# Altium schematic sheet Power_Supply.SchDoc
size A4; CompanyName: Technische Hochschule Nürnberg Georg Simon Ohm; Organization: UltraZohm; Address1: Kesslerplatz 12; Address2: 90489 Nürnberg; Address3: GERMANY; DocumentNumber: 8; SheetNumber: 8; SheetTotal: 9; Website: www.ultrazohm.com
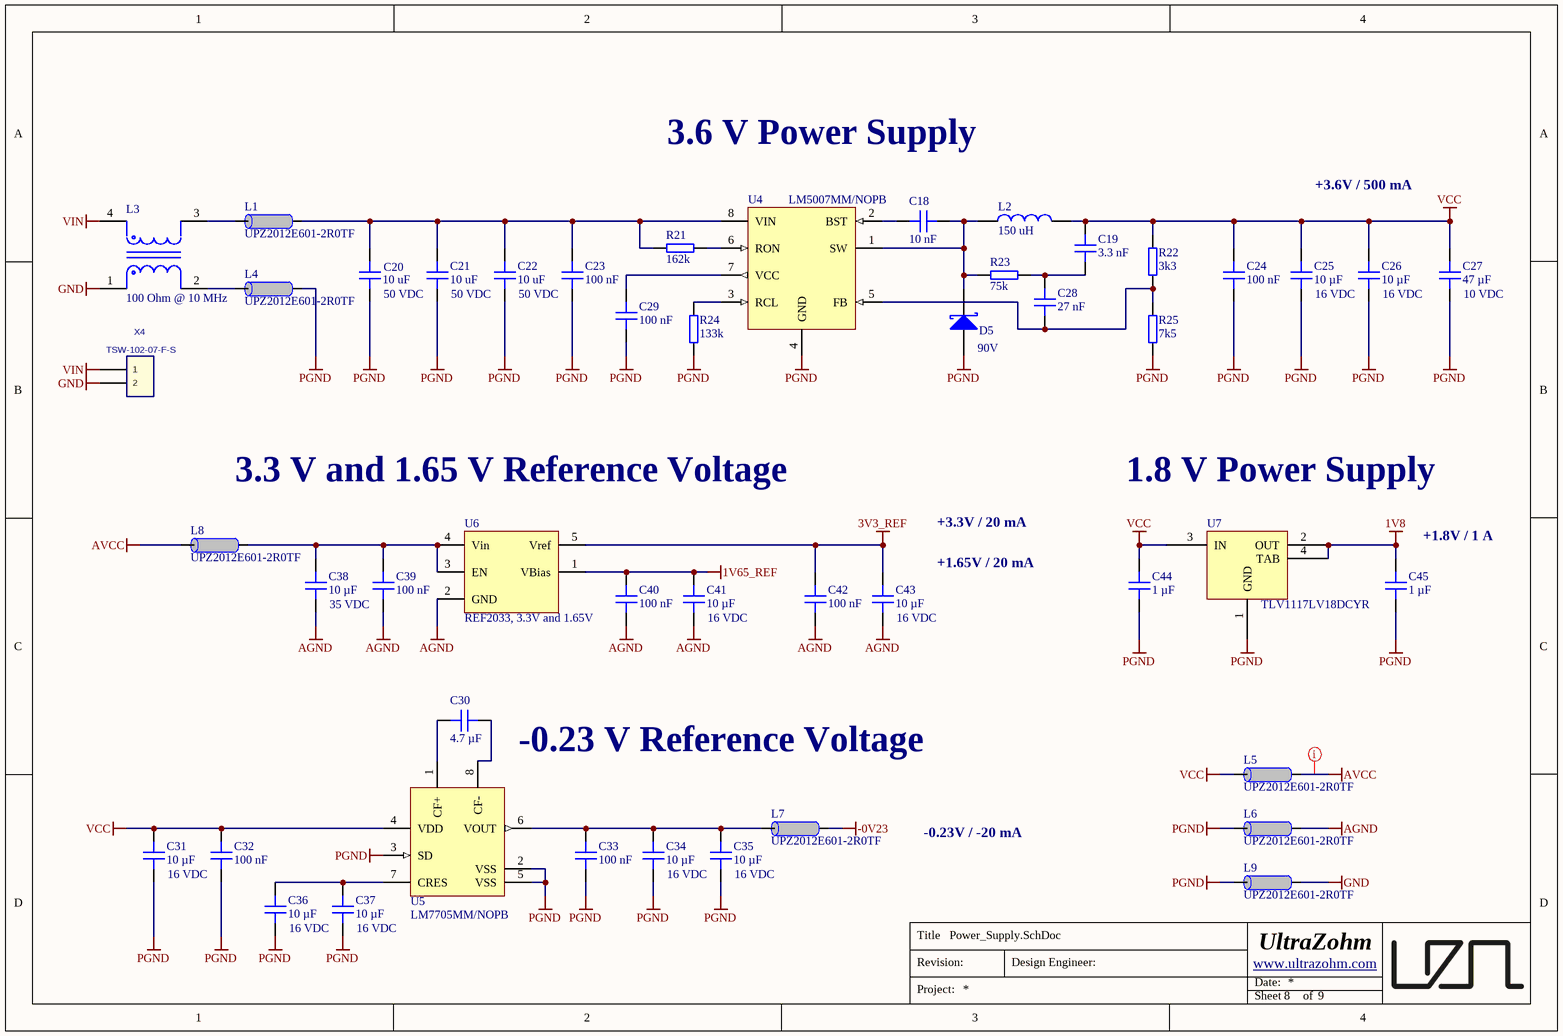
[diagram p0: Power_Supply.SchDoc]

## Parts
C18  10 nF  [C_0603]
C19  3.3 nF  [C_0603]
C20  10 uF  Voltage Rating: 50 VDC  [C_1206]
C21  10 uF  Voltage Rating: 50 VDC  [C_1206]
C22  10 uF  Voltage Rating: 50 VDC  [C_1206]
C23  100 nF  [C_0603]
C24  100 nF  [C_0603]
C25  10 µF  Voltage Rating: 16 VDC  [C_0603]
C26  10 µF  Voltage Rating: 16 VDC  [C_0603]
C27  47 µF  Voltage Rating: 10 VDC  [C_1210_N]
C28  27 nF  [C_0603]
C29  100 nF  [C_0603]
C30  4.7 µF  [C_0805]
C31  10 µF  Voltage Rating: 16 VDC  [C_0603]
C32  100 nF  [C_0603]
C33  100 nF  [C_0603]
C34  10 µF  Voltage Rating: 16 VDC  [C_0603]
C35  10 µF  Voltage Rating: 16 VDC  [C_0603]
C36  10 µF  Voltage Rating: 16 VDC  [C_0603]
C37  10 µF  Voltage Rating: 16 VDC  [C_0603]
C38  10 µF  Voltage Rating: 35 VDC  [CAPC_0805_L]
C39  100 nF  [C_0603]
C40  100 nF  [C_0603]
C41  10 µF  Voltage Rating: 16 VDC  [C_0603]
C42  100 nF  [C_0603]
C43  10 µF  Voltage Rating: 16 VDC  [C_0603]
C44  1 µF  [C_0603]
C45  1 µF  [C_0603]
D5  90V  [DIOM5226X262N]
L1  UPZ2012E601-2R0TF  [INDC2012X92N_V]
L2  150 uH  [POWER_INDUCTOR_8040]
L3  100 Ohm @ 10 MHz  [FP-DLW5BT-MFG]
L4  UPZ2012E601-2R0TF  [INDC2012X92N_V]
L5  UPZ2012E601-2R0TF  [INDC2012X92N_V]
L6  UPZ2012E601-2R0TF  [INDC2012X92N_V]
L7  UPZ2012E601-2R0TF  [INDC2012X92N_V]
L8  UPZ2012E601-2R0TF  [INDC2012X92N_V]
L9  UPZ2012E601-2R0TF  [INDC2012X92N_V]
R21  162k  [RES 0603_1608]
R22  3k3  [RES 0603_1608]
R23  75k  [RES 0603_1608]
R24  133k  [RES 0603_1608]
R25  7k5  [RES 0603_1608]
U4  LM5007MM/NOPB  [TSOP65P490X110-8N]
U5  LM7705MM/NOPB  [MSOP-8_DGK0008A_L]
U6  REF2033, 3.3V and 1.65V  [SOT23-5_N]
U7  TLV1117LV18DCYR  [SOT230P700X170-4N]
X4  TSW-102-07-F-S  [TSW-102-XX-XXX-S]

## Nets
1V8: C45.2 U7.2(OUT) U7.4(TAB)
1V65_REF: C40.2 C41.2 U6.1(VBias)
3V3_REF: C42.2 C43.2 U6.5(Vref)
-0V23: L7.1
AGND: C38.1 C39.1 C40.1 C41.1 C42.1 C43.1 L6.1 U6.2(GND)
AVCC: L5.1 L8.2
GND: L3.1 L9.1 X4.2
PGND: C20.1 C21.1 C22.1 C23.1 C24.1 C25.1 C26.1 C27.1 C29.1 C31.1 C32.1 C33.1 C34.1 C35.1 C36.1 C37.1 C44.1 C45.1 D5.2(A) L4.1 L6.2 L9.2 R24.1 R25.1 U4.4(GND) U5.2(VSS) U5.3(SD) U5.5(VSS) U7.1(GND)
VCC: C19.2 C24.2 C25.2 C26.2 C27.2 C31.2 C32.2 C44.2 L2.2 L5.2 R22.2 U5.4(VDD) U7.3(IN)
VIN: L3.4 X4.1
NetC18_1: C18.1 U4.2(BST)
NetC18_2: C18.2 D5.1(K) L2.1 R23.1 U4.1(SW)
NetC19_1: C19.1 C28.2 R23.2
NetC20_2: C20.2 C21.2 C22.2 C23.2 L1.1 R21.1 U4.8(VIN)
NetC28_1: C28.1 R22.1 R25.2 U4.5(FB)
NetC29_2: C29.2 U4.7(VCC)
NetC30_1: C30.1 U5.1(CF+)
NetC30_2: C30.2 U5.8(CF-)
NetC33_2: C33.2 C34.2 C35.2 L7.2 U5.6(VOUT)
NetC36_2: C36.2 C37.2 U5.7(CRES)
NetC38_2: C38.2 C39.2 L8.1 U6.3(EN) U6.4(Vin)
NetL1_2: L1.2 L3.3
NetL3_2: L3.2 L4.2
NetR21_2: R21.2 U4.6(RON)
NetR24_2: R24.2 U4.3(RCL)

## Layout directives
net class PWR: AVCC

## Notes on the sheet
- 3.6 V Power Supply
- +3.6V / 500 mA
- 3.3 V and 1.65 V Reference Voltage
- 1.8 V Power Supply
- +3.3V / 20 mA
- +1.65V / 20 mA
- (near C45) +1.8V / 1 A
- -0.23 V Reference Voltage
- -0.23V / -20 mA
- Title
- Revision:
- Design Engineer:
- Date:
- Project:
- Sheet
- of

## Library data of the parts
C18 = 0603B103K500NT: 50V 10nF X7R ±10% 0603  Multilayer Ceramic Capacitors MLCC - SMD/SMT ROHS; Manufacturer: FH (Guangdong Fenghua Advanced Tech); Voltage Rating: 50 VDC; Created from: AGeiger; Manufacturer Part Number: 0603B103K500NT; PartID: 108; Created On: 21.09.2022 07:22:21; ComponentLink1Description: Datasheet; ComponentLink1URL: https://datasheet.lcsc.com/lcsc/2102081402_FH--Guangdong-Fenghua-Advanced-Tech-0603B103K500NT_C57112.pdf; Component Type: Capacitor 0603; Device Package: 0603; Last Updated: 21.09.2022 07:22:21; Mounting Type: SMD; Operating Temperature: -55 - 125°C; Series: X7R; Supplier 1: LCSC; Supplier Part Number 1: C57112; Type: Capacitor; Tolerance: 10 %; Value: 10 nF; Live Cycle Status: 1; LCSC Part Number: C57112
C19 = CL10B332KB8NNNC: 50V 3.3nF X7R ±10% 0603  Multilayer Ceramic Capacitors MLCC - SMD/SMT ROHS; Manufacturer: Samsung Electro-Mechanics; Voltage Rating: 50 VDC; Created from: AGeiger; Manufacturer Part Number: CL10B332KB8NNNC; PartID: 110; Created On: 21.09.2022 08:06:27; ComponentLink1Description: Datasheet; ComponentLink1URL: https://datasheet.lcsc.com/lcsc/1810261513_Samsung-Electro-Mechanics-CL10B332KB8NNNC_C1613.pdf; Component Type: Capacitor 0603; Device Package: 0603; Last Updated: 21.09.2022 08:06:27; Mounting Type: SMD; Operating Temperature: -55 - 125°C; Series: X7R; Supplier 1: LCSC; Supplier Part Number 1: C1613; Type: Capacitor; Tolerance: 10 %; Value: 3.3 nF; Live Cycle Status: 1; LCSC Part Number: C1613
C20-C22 = CL31B106KBHNNNE: 50V 10uF X7R ±10% 1206  Multilayer Ceramic Capacitors MLCC - SMD/SMT ROHS; Manufacturer: Samsung Electro-Mechanics; Created from: AGeiger; Manufacturer Part Number: CL31B106KBHNNNE; PartID: 107; Created On: 20.09.2022 20:14:50; ComponentLink1Description: Datasheet; ComponentLink1URL: https://datasheet.lcsc.com/lcsc/1810221111_Samsung-Electro-Mechanics-CL31B106KBHNNNE_C89632.pdf; Component Type: Capacitor 1206; Device Package: 1206; Last Updated: 20.09.2022 20:14:50; Mounting Type: SMD; Operating Temperature: -55 - 125°C; Series: X7R; Supplier 1: LCSC; Supplier Part Number 1: C89632; Type: Capacitor; Tolerance: 10 %; Value: 10 uF; Live Cycle Status: 1; LCSC Part Number: C89632
C23 C24 C29 C32 C33 C39 C40 C42 = CC0603KRX7R9BB104: Capacitor 0603, 50 VDC, 100 nF, X7R; Manufacturer: YAGEO; Tolerance: 10 %; Voltage Rating: 50 VDC; Created from: AGeiger; Manufacturer Part Number: CC0603KRX7R9BB104; PartID: 102; Created On: 22.08.2022 14:35:53; ComponentLink1Description: Datasheet; ComponentLink1URL: https://datasheet.lcsc.com/lcsc/1809301912_YAGEO-CC0603KRX7R9BB104_C14663.pdf; Component Type: Capacitor 0603; Device Package: 0603; Last Updated: 22.08.2022 14:35:53; Mounting Type: SMD; Operating Temperature: -55 - 125°C; Series: X7R; Supplier 1: LCSC; Supplier Part Number 1: C14663; Supplier 2: Mouser; Supplier Part Number 2: 603-CC603KRX7R9BB104; Type: Capacitor; Value: 100 nF; Live Cycle Status: 1; LCSC Part Number: C14663
C25 C26 C31 C34-C37 C41 C43 = CL10A106MO8NQNC: Capacitor 0603, 16 VDC, 10 µF, X5R; Manufacturer: Samsung Electro-Mechanics; Tolerance: 20 %; Created from: AGeiger; Manufacturer Part Number: CL10A106MO8NQNC; PartID: 101; Created On: 22.08.2022 13:56:44; ComponentLink1Description: Datasheet; ComponentLink1URL: https://datasheet.lcsc.com/lcsc/1810261909_Samsung-Electro-Mechanics-CL10A106MO8NQNC_C92487.pdf; Component Type: Capacitor 0603; Device Package: 0603; Last Updated: 22.08.2022 13:56:44; Mounting Type: SMD; Operating Temperature: -55 - 85°C; Supplier 1: LCSC; Supplier Part Number 1: C92487; Type: Capacitor; Value: 10 µF; Live Cycle Status: 1; LCSC Part Number: C92487
C27 = GRM32ER71A476KE15L: 10V 47uF X7R ±10% 1210  Multilayer Ceramic Capacitors MLCC - SMD/SMT ROHS; Manufacturer: Murata Electronics; Created from: AGeiger; Manufacturer Part Number: GRM32ER71A476KE15L; PartID: 111; Created On: 21.09.2022 16:18:50; ComponentLink1Description: Datasheet; ComponentLink1URL: https://datasheet.lcsc.com/lcsc/1811071031_Murata-Electronics-GRM32ER71A476KE15L_C84494.pdf; Component Type: Capacitor 1210; Device Package: 1210; Last Updated: 21.09.2022 16:18:50; Mounting Type: SMD; Operating Temperature: -55 - 125°C; Series: GRM; Supplier 1: LCSC; Supplier Part Number 1: C84494; Type: Capacitor; Tolerance: 10 %; Value: 47 µF; Live Cycle Status: 1; LCSC Part Number: C84494
C28 = CC0603KRX7R9BB273: 50V 27nF X7R ±10% 0603  Multilayer Ceramic Capacitors MLCC - SMD/SMT ROHS; Manufacturer: YAGEO; Voltage Rating: 50 VDC; Created from: AGeiger; Manufacturer Part Number: CC0603KRX7R9BB273; PartID: 109; Created On: 21.09.2022 07:36:06; ComponentLink1Description: Datasheet; ComponentLink1URL: https://datasheet.lcsc.com/lcsc/1811082119_YAGEO-CC0603KRX7R9BB273_C107086.pdf; Component Type: Capacitor 0603; Device Package: 0603; Last Updated: 21.09.2022 07:36:06; Mounting Type: SMD; Operating Temperature: -55 - 125°C; Series: X7R; Supplier 1: LCSC; Supplier Part Number 1: C107086; Type: Capacitor; Tolerance: 10 %; Value: 27 nF; Live Cycle Status: 1; LCSC Part Number: C107086
C30 = CL21A475KAQNNNE: 25V 4.7uF X5R ±10% 0805  Multilayer Ceramic Capacitors MLCC - SMD/SMT ROHS; Manufacturer: Samsung Electro-Mechanics; Voltage Rating: 25 VDC; Created from: AGeiger; Manufacturer Part Number: CL21A475KAQNNNE; PartID: 113; Created On: 20.11.2022 14:23:36; ComponentLink1Description: Datasheet; ComponentLink1URL: https://datasheet.lcsc.com/lcsc/1810261822_Samsung-Electro-Mechanics-CL21A475KAQNNNE_C1779.pdf; Component Type: Capacitor 0805; Device Package: 0805; Last Updated: 20.11.2022 14:23:36; Mounting Type: SMD; Operating Temperature: -55 to +85°C; Series: X5R; Supplier 1: LCSC; Supplier Part Number 1: C1779; Type: Capacitor; Tolerance: 10 %; Value: 4.7 µF; Live Cycle Status: 1; LCSC Part Number: C1779
C38 = GRM21BR6YA106KE43L: Capacitor 0805, 35 VDC, 10 µF, X5R; Manufacturer: Murata Electronics; Tolerance: 10 %; Created from: AGeiger; Manufacturer Part Number: GRM21BR6YA106KE43L; PartID: 28; Created On: 20.12.2020 13:54:13; ComponentLink1Description: Datasheet; ComponentLink1URL: https://www.mouser.de/datasheet/2/281/murata_03052018_GRM_Series_1-1310166.pdf; Component Type: Capacitor 0805; Device Package: 0805; Last Updated: 29.11.2022 14:28:59; Mounting Type: SMD; Operating Temperature: -55 - 85°C; Series: GRM; Supplier 1: Mouser; Supplier Part Number 1: 81-GRM21BR6YA106KE3L; Type: Capacitor; Value: 10 µF; Live Cycle Status: 1; LCSC Part Number: C162422; Stock number: Labor SMD Container; Supplier 2: LCSC; Supplier Part Number 2: C162422
C44 C45 = UMK107AB7105KA-T: 50V 1uF X7R ±10% 0603 Multilayer Ceramic Capacitors MLCC - SMD/SMT ROHS; Manufacturer: Taiyo Yuden; Voltage Rating: 50 VDC; Created from: NDiringer; Manufacturer Part Number: UMK107AB7105KA-T; PartID: 98; Created On: 09.08.2022 09:35:02; ComponentLink1Description: Datasheet; ComponentLink1URL: https://www.mouser.de/datasheet/2/396/mlcc02_e-1307760.pdf; Component Type: Capacitor 0603; Device Package: 0603; Last Updated: 21.09.2022 16:11:37; Mounting Type: SMD; Operating Temperature: -55 - 125°C; Series: X7R; Supplier 1: LCSC; Supplier Part Number 1: C105174; Supplier 2: Mouser; Supplier Part Number 2: 963-UMK107AB7105MA-T; Type: Capacitor; Tolerance: 10 %; Value: 1 µF; Live Cycle Status: 1; LCSC Part Number: C105174; Stock number: not stored
D5 = BX39_R1_00001: Schottky Diode, 90 V, 3 A; MPN: BYS12-90-E3/TR3; Manufacturer: PANJIT International; MF: Vishay; Forward Voltage: 0.8 V; Rated Current: 1.5A; Forward Current: 3 A; Created from: AGeiger; Package: DO-214AC; Supplier 1: LCSC; Supplier 2: Mouser; Supplier 3: Digi-Key; Supplier Part Number 1: C263143; Supplier Part Number 2: 625-BYS12-90-E3/TR3; Supplier Part Number 3: BYS12-90-E3/GICT-ND; Reverse Voltage: 90V; Manufacturer Part Number: BX39_R1_00001; PartID: 10; Created On: 21.09.2022 07:47:45; ComponentLink1Description: Datasheet; ComponentLink1URL: https://datasheet.lcsc.com/lcsc/1809071741_PANJIT-International-BX39-R1-00001_C263143.pdf; Component Type: Schottky Diode; Device Package: SMA (DO-214AC); Last Updated: 29.11.2022 14:28:08; Mounting Type: SMD; Operating Temperature: -65 - 175 °C; Series: BX39; Type: Schottky Diode; Value: 90V; Live Cycle Status: 1; LCSC Part Number: C263143
L1 L4-L9 = UPZ2012E601-2R0TF: 2A 1 90mΩ 600Ω@100MHz ±25% 0805  Ferrite Beads ROHS; Manufacturer: Sunlord; Value: 90 Ohm; Created from: AGeiger; Manufacturer Part Number: UPZ2012E601-2R0TF; PartID: 11; Created On: 03.09.2022 16:57:01; ComponentLink1Description: Datasheet; ComponentLink1URL: https://datasheet.lcsc.com/lcsc/2110091730_Sunlord-UPZ2012E601-2R0TF_C98308.pdf; Component Type: Ferrite Beads; Device Package: 0805; Last Updated: 03.09.2022 17:01:04; Mounting Type: SMD; Operating Temperature: -55 - 125 °C; Supplier 1: LCSC; Supplier Part Number 1: C98308; Type: Ferrite Bead; DC current: 2 A; Live Cycle Status: 1; LCSC Part Number: C98308
L2 = CKCS8040-150uH/M: 850mA 150uH ±20% 410mΩ SMD  Power Inductors ROHS; Manufacturer: CENKER; MF: EPCOS / TDK; DCR: 320m; Rated Current: 0.85 A; Created from: AGeiger; MPN: B82464G4154M; Supplier 1: LCSC; Supplier Part Number 1: C354644; Value: 150 uH; Manufacturer Part Number: CKCS8040-150uH/M; PartID: 12; Created On: 21.09.2022 15:49:30; ComponentLink1Description: Datasheet; ComponentLink1URL: https://datasheet.lcsc.com/lcsc/1912111437_CENKER-CKCS8040-150uH-M_C354644.pdf; Component Type: SMD Power Inductor; Device Package: 8x8x4mm; Last Updated: 21.09.2022 15:49:30; Mounting Type: SMD; Operating Temperature: -25 to +125 °C; Series: CKCS8040; Type: Inductor; DC current: 0.85 A; Live Cycle Status: 1; LCSC Part Number: C354644
L3 = DLW5BTH142TQ2L: -40℃~125℃ 1.5A 56mΩ 50V 100Ω @ 10MHz 125VDC SMD,5x5mm Common Mode Filters ROHS; Manufacturer: Murata; Number of Lines: 2; DC Resistance (DCR): 56mR; Type: Common Mode Choke; Created from: AGeiger; Packaging: Cut Tape; Ratings: AEC-Q200; Mount: Surface Mount; Max Operating Temperature: 125°C; Min Operating Temperature: -40°C; Voltage Rating (DC): 50V; Max Current Rating: 1.5A; Manufacturer Part Number: DLW5BTH142TQ2L; PartID: 13; Created On: 18.10.2022 16:07:46; ComponentLink1Description: Datasheet; ComponentLink1URL: https://datasheet.lcsc.com/lcsc/1912111437_Murata-Electronics-DLW5BTH142TQ2L_C393166.pdf; Component Type: Common Mode Choke; Device Package: SMD,5x5mm; Last Updated: 18.10.2022 16:07:46; Mounting Type: SMD; Operating Temperature: -40 to +125°C; Series: DLW; Supplier 1: LCSC; Supplier Part Number 1: C393166; DC current: 1.5A; Value: 100 Ohm @ 10 MHz; Live Cycle Status: 1; LCSC Part Number: C393166
R21 = 0603WAF1623T5E: 100mW Thick Film Resistors 75V ±100ppm/℃ ±1% -55℃~+155℃ 162kΩ 0603 Chip Resistor - Surface Mount ROHS; Manufacturer: UNI-ROYAL; Created from: AGeiger; Manufacturer Part Number: 0603WAF1623T5E; PartID: 241; Created On: 20.09.2022 21:15:04; ComponentLink1Description: Datasheet; ComponentLink1URL: https://datasheet.lcsc.com/lcsc/2206010130_UNI-ROYAL-Uniroyal-Elec-0603WAF1623T5E_C22815.pdf; Component Type: SMD resistor; Device Package: 0603; Last Updated: 20.09.2022 21:15:04; Mounting Type: SMD; Supplier 1: LCSC; Supplier Part Number 1: C22815; Type: Resistor; Tolerance: 1%; Value: 162k; Live Cycle Status: 1; LCSC Part Number: C22815
R22 = 0603WAF3301T5E: 100mW Thick Film Resistors 75V ±100ppm/℃ ±1% -55℃~+155℃ 3.3kΩ 0603  Chip Resistor - Surface Mount ROHS; Manufacturer: UNI-ROYAL; Created from: AGeiger; Manufacturer Part Number: 0603WAF3301T5E; PartID: 245; Created On: 21.09.2022 16:03:17; ComponentLink1Description: Datasheet; ComponentLink1URL: https://datasheet.lcsc.com/lcsc/2206010116_UNI-ROYAL-Uniroyal-Elec-0603WAF3301T5E_C22978.pdf; Component Type: SMD resistor; Device Package: 0603; Last Updated: 21.09.2022 16:03:17; Mounting Type: SMD; Supplier 1: LCSC; Supplier Part Number 1: C22978; Type: Resistor; Tolerance: 1%; Value: 3k3; Live Cycle Status: 1; LCSC Part Number: C22978
R23 = 0603WAF7502T5E: 100mW Thick Film Resistors 75V ±100ppm/℃ ±1% -55℃~+155℃ 75kΩ 0603  Chip Resistor - Surface Mount ROHS; Manufacturer: UNI-ROYAL; Created from: AGeiger; Manufacturer Part Number: 0603WAF7502T5E; PartID: 243; Created On: 21.09.2022 07:29:06; ComponentLink1Description: Datasheet; ComponentLink1URL: https://datasheet.lcsc.com/lcsc/2206010100_UNI-ROYAL-Uniroyal-Elec-0603WAF7502T5E_C23242.pdf; Component Type: SMD resistor; Device Package: 0603; Last Updated: 21.09.2022 07:29:06; Mounting Type: SMD; Supplier 1: LCSC; Supplier Part Number 1: C23242; Type: Resistor; Tolerance: 1%; Value: 75k; Live Cycle Status: 1; LCSC Part Number: C23242
R24 = AC0603FR-07133KL: 100mW Thick Film Resistors 75V ±1% ±100ppm/℃ 133kΩ -55℃~+155℃ 0603  Chip Resistor - Surface Mount ROHS; Manufacturer: YAGEO; Created from: AGeiger; Manufacturer Part Number: AC0603FR-07133KL; PartID: 242; Created On: 20.09.2022 21:20:57; ComponentLink1Description: Datasheet; ComponentLink1URL: https://datasheet.lcsc.com/lcsc/1811082121_YAGEO-AC0603FR-07133KL_C227577.pdf; Component Type: SMD resistor; Device Package: 0603; Last Updated: 20.09.2022 21:20:57; Mounting Type: SMD; Supplier 1: LCSC; Supplier Part Number 1: C227577; Type: Resistor; Tolerance: 1%; Value: 133k; Live Cycle Status: 1; LCSC Part Number: C227577
R25 = 0603WAF7501T5E: 100mW Thick Film Resistors 75V ±100ppm/℃ ±1% -55℃~+155℃ 7.5kΩ 0603  Chip Resistor - Surface Mount ROHS; Manufacturer: UNI-ROYAL; Created from: AGeiger; Manufacturer Part Number: 0603WAF7501T5E; PartID: 244; Created On: 21.09.2022 16:01:20; ComponentLink1Description: Datasheet; ComponentLink1URL: https://datasheet.lcsc.com/lcsc/2206010100_UNI-ROYAL-Uniroyal-Elec-0603WAF7501T5E_C23234.pdf; Component Type: SMD resistor; Device Package: 0603; Last Updated: 21.09.2022 16:01:20; Mounting Type: SMD; Supplier 1: LCSC; Supplier Part Number 1: C23234; Type: Resistor; Tolerance: 1%; Value: 7k5; Live Cycle Status: 1; LCSC Part Number: C23234
U4 = LM5007MM/NOPB: Buck Converter with 80 V integrated Power MOSFET, U_in 9 V - 75 V, U_out 2.5 V - 73 V, I_out 500 mA; Manufacturer: Texas Instruments; Value: 500 mA; Created from: AGeiger; Manufacturer Part Number: LM5007MM/NOPB; PartID: 7; Created On: 06.01.2021 09:48:37; ComponentLink1Description: Datasheet; ComponentLink1URL: https://www.ti.com/general/docs/suppproductinfo.tsp?distId=26&gotoUrl=http%3A%2F%2Fwww.ti.com%2Flit%2Fgpn%2Flm5007; Component Type: Buck Converter; Device Package: -; Last Updated: 20.09.2022 20:27:25; Mounting Type: SMD; Series: LM5007; Supplier 1: Mouser; Supplier Part Number 1: 926-LM5007MM/NOPB; Supplier 2: LCSC; Supplier Part Number 2: C23920; Type: Buck Converter; Live Cycle Status: 1; LCSC Part Number: C23920; Stock number: not stored
U5 = LM7705MM/NOPB: Low-Noise Negative Bias Generator; MF: Texas Instruments; OperationTempMin: -40°C; OperationTempMax: +125°C; Value: -0.23V; Created from: AGeiger; ComponentLink1Description: Datasheet; ComponentLink1URL: https://www.ti.com/lit/ds/symlink/lm7705.pdf?ts=1668951598020; Package: VSSOP-8 (DGK0008A); MPN: LM7705MM/NOPB; Manufacturer Part Number: LM7705MM/NOPB; PartID: 22; Created On: 20.11.2022 14:06:38; Component Type: Switched voltage inverter; Device Package: MSOP-8; Last Updated: 20.11.2022 14:06:38; Manufacturer: Texas Instruments; Mounting Type: SMD; Operating Temperature: -40 to +125 °C; Supplier 1: LCSC; Supplier Part Number 1: C129980; Type: Step-down; Live Cycle Status: 1; LCSC Part Number: C129980; Stock number: not stored
U6 = REF2033AIDDCT: REF20xx Low-Drift, Low-Power, Dual-Output, VREF and VREF / 2 Voltage References; Manufacturer: Texas Instruments; Created from: AGeiger; Digikey Part-Number: 296-40487-1-ND; Manufacturer Part Number: REF2033AIDDCT; PartID: 12; Created On: 20.09.2022 16:03:22; ComponentLink1Description: Datasheet; ComponentLink1URL: https://www.ti.com/lit/ds/symlink/ref2033.pdf?HQS=dis-mous-null-mousermode-dsf-pf-null-wwe&ts=1661952535444&ref_url=https%253A%252F%252Fwww.mouser.de%252F; Component Type: Voltage Reference; Device Package: SMD; Last Updated: 20.09.2022 16:03:22; Mounting Type: SMD; Operating Temperature: -40 - 125 °C; Series: REF20xx; Supplier 1: LCSC; Supplier Part Number 1: C181409; Type: Voltage Reference; Value: REF2033, 3.3V and 1.65V; Live Cycle Status: 1; LCSC Part Number: C181409; Stock number: not stored
U7 = TLV1117LV18DCYR: 1-A, Positive Fixed-Voltage, Low-Dropout Regulator; MF: Texas Instruments; Voltage Output: 1.8 V; Voltage Input Max: 5.5 V; Current Max: 1 A; Value: 1.8V; Created from: AGeiger; MPN: TLV1117LV18DCYR; Supplier 1: LCSC; Supplier Part Number 1: C80105; Manufacturer Part Number: TLV1117LV18DCYR; PartID: 23; Created On: 28.11.2022 16:53:03; ComponentLink1Description: Datasheet; ComponentLink1URL: https://www.ti.com/lit/ds/symlink/tlv1117lv.pdf?HQS=dis-mous-null-mousermode-dsf-pf-null-wwe&ts=1669592607754&ref_url=https%253A%252F%252Fwww.mouser.de%252F; Component Type: Low Dropout Regulator; Device Package: SOT-223; Last Updated: 28.11.2022 16:53:03; Manufacturer: Texas Instruments; Mounting Type: SMD; Operating Temperature: -40 to +125 °C; Type: Low Dropout Regulator; Live Cycle Status: 1; LCSC Part Number: C80105; Stock number: not stored
X4 = TSW-102-07-F-S: Pin Header, 2.54mm, 2x1; MANUFACTURER: SAMTEC; Created from: AGeiger; Number of positions: 2; CREATED BY: May 18, 2016 - Wendy Xin; PCB DECAL: TSW-102-XX-XXX-S; Manufacturer Part Number: TSW-102-07-F-S; PartID: 13; Created On: 02.12.2022 15:20:24; ComponentLink1Description: Datasheet; ComponentLink1URL: https://suddendocs.samtec.com/catalog_english/tsw_th.pdf; Component Type: Pin Header; Device Package: THT; Last Updated: 02.12.2022 15:20:30; Mounting Type: THT; Operating Temperature: -55 to +125 °C; Series: TSW; Supplier 1: Mouser; Supplier Part Number 1: 200-TSW10207FS; Type: Pin Header; Live Cycle Status: 1; Stock number: not stored; Number of rows: 1